# Altium project GreenMeter_VER1.PrjPcb
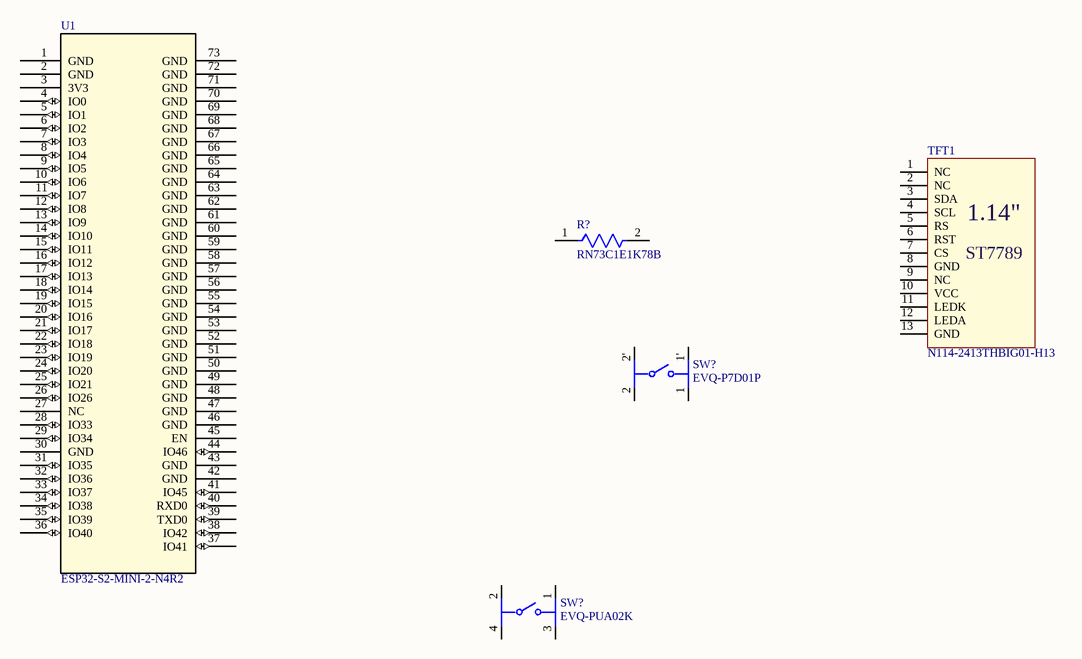
[diagram p0: ESP32.SchDoc]
1 sheet, 5 parts. Net scope: global (net labels, ports and power ports of the same name join across sheets).
Board file: GreenMeter_VER1_PCB.PcbDoc

## Sheet ESP32.SchDoc
size A4; SheetNumber: 1; SheetTotal: 1

### Parts
(Parts that share a designator on the sheet are numbered #1, #2 ... from top to bottom, then left to right.)
R?  RN73C1E1K78B  [FP-RN731E-MFG]
SW?#1  EVQ-P7D01P  [FP-EVQ-P7D01P-MFG]
SW?#2  EVQ-PUA02K  [FP-EVQ-PUA02K-MFG]
TFT1  N114-2413THBIG01-H13  [N114-2413THBIG01-H13]
U1  ESP32-S2-MINI-2-N4R2  [ESP32-S2-MINI-1-N4_EXP]

### Nets

Not connected (* = marked no-connect by the designer): R? 1 2; SW?#1 1 1' 2 2'; SW?#2 1 2 3 4; TFT1 1(NC) 2(NC) 3(SDA) 4(SCL) 5(RS) 6(RST) 7(CS) 8(GND) 9(NC) 10(VCC) 11(LEDK) 12(LEDA) 13(GND); U1 1(GND) 2(GND) 3(3V3) 4(IO0) 5(IO1) 6(IO2) 7(IO3) 8(IO4) 9(IO5) 10(IO6) 11(IO7) 12(IO8) 13(IO9) 14(IO10) 15(IO11) 16(IO12) 17(IO13) 18(IO14) 19(IO15) 20(IO16) 21(IO17) 22(IO18) 23(IO19) 24(IO20) 25(IO21) 26(IO26) 27(NC) 28(IO33) 29(IO34) 30(GND) 31(IO35) 32(IO36) 33(IO37) 34(IO38) 35(IO39) 36(IO40) 37(IO41) 38(IO42) 39(TXD0) 40(RXD0) 41(IO45) 42(GND) 43(GND) 44(IO46) 45(EN) 46(GND) 47(GND) 48(GND) 49(GND) 50(GND) 51(GND) 52(GND) 53(GND) 54(GND) 55(GND) 56(GND) 57(GND) 58(GND) 59(GND) 60(GND) 61(GND) 62(GND) 63(GND) 64(GND) 65(GND) 66(GND) 67(GND) 68(GND) 69(GND) 70(GND) 71(GND) 72(GND) 73(GND)

### Notes on the sheet
- (in symbol N114-2413THBIG01-H13) 1.14"

### Library data of the parts
R? = CMP-03211-005252-1: Res Thin Film 0402 1.78KΩ 0.1% 1/16W 10ppm/°C Molded SMD; Manufacturer: TE Connectivity; Power Rating: 0.063W; Voltage Rating: 25V; Device Class L3: Chip SMD Resistors; Temperature Range Low: -55°C; Composition: Thin Film; Manufacturer Part Number: RN73C1E1K78B; Category: Res; Ipc Land Pattern Name: RESC10050X30; Temperature Range High: +155°C; Octopart: https://octopart.com/rn73c1e1k78b-te+connectivity-12153919; Series: RN73; Resistance: 1.78KΩ; Device Class L1: Passive Components; Lead Free: Yes; Automotive: No; octopart_url: https://octopart.com/rn73c1e1k78b-te+connectivity-12153919; Value: 1.78KΩ; Device Class L2: Resistors; ComponentLink2Description: Datasheet; RoHS: TRUE; Package: RN731E; Temperature: -55°C to +155°C; ComponentLink2URL: https://www.te.com/commerce/DocumentDelivery/DDEController?Action=showdoc&DocId=Data+Sheet%7F1773270%7FP%7Fpdf%7FEnglish%7FENG_DS_1773270_P.pdf%7F1-1879132-6; Height: 0.35mm; Tolerance: 0.1%; Temperature Coefficient: 10ppm/°C
SW?#1 = CMP-05618-000096-1: SWITCH TACTILE SPST-NO 0.05A 12V; Mechanical Life: 100000Cycles; Throw Configuration: SPST; Switch Function: Off-Mom; Actuator Length: 1.7mm; Switch Travel: 0.2mm; Contact Current Rating: 50mA; Illumination Type: Non-Illuminated; Operating Force: 2.2N; Min Operating Temperature: -20°C; Mount: Surface Mount; Max Operating Temperature: 70°C; Case/Package: SMD/SMT; Packaging: Tape and Reel; Package Quantity: 5000; Radiation Hardening: No; Max Voltage Rating (DC): 12V; Termination: J-Bend; Lead Free: Lead Free
SW?#2 = CMP-05618-000133-1: SWITCH TACTILE SPST-NO 0.05A 12V; Operating Force: 2.2N; Switch Function: Off-Mom; Switch Travel: 0.3mm; Max Current Rating: 50mA; Contact Resistance: 500mR; Throw Configuration: SPST; Actuator Color: Black; Illumination Type: Non-Illuminated; Electrical Life: 100000Cycles; Actuator Length: 1mm; Radiation Hardening: No; Mount: Surface Mount; Lead Free: Lead Free; Packaging: Tape and Reel; Orientation: Straight; Series: EVQPU; Depth: 4.5mm; Min Operating Temperature: -20°C; RoHS Compliant: Yes; Contact Plating: Gold; Package Quantity: 1; Size: 3.5mm; Contact Current Rating: 50mA; Voltage Rating (DC): 12V; Current Rating: 50mA; Length: 6.4mm; Max Operating Temperature: 70°C; Termination: Gull Wing; Max Voltage Rating (DC): 12V; Mechanical Life: 100000Cycles
TFT1 = N114-2413THBIG01-H13: ST7789; LCSC Part #: C2890618
U1 = ESP32-S2-MINI-2-N4R2: No Description Available; Mfr_Name: Espressif Systems; RefDes: RefDes; Type: Type; LCSC Part #: C3013908